# EAGLE design SparkSwitch (EAGLE 9.6.2)
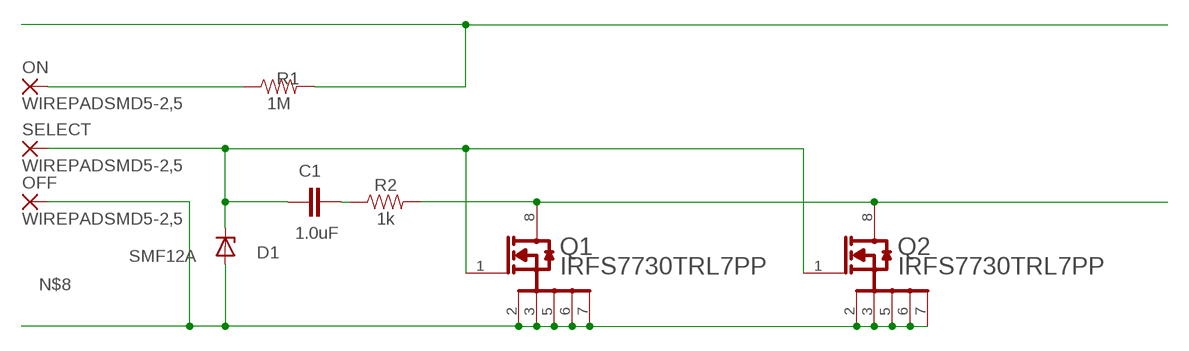
[diagram p0: schematic, sheet 1]

## Parts
C1  1.0uF  1.0UF-0805-25V-(+80/-20%)  [0805]
D1  SMF12A  [SOD123F]
OFF  WIREPADSMD5-2,5  [5-2,5]
ON  WIREPADSMD5-2,5  [5-2,5]
Q1  INFINEON_IRFS7730TRL7PPINFINEON_IRFS7730TRL7PP_0_0  [INFINEON_IRFS7730TRL7PP_0]
Q2  INFINEON_IRFS7730TRL7PPINFINEON_IRFS7730TRL7PP_0_0  [INFINEON_IRFS7730TRL7PP_0]
R1  1M  1MOHM-0603-1/4W-5%  [0603]
R2  1k  1KOHM-0603-1/10W-1%  [0603]
SELECT  WIREPADSMD5-2,5  [5-2,5]

## Nets
N$2: Q1.8(D) Q2.8(D) R2.2
N$3: C1.1 D1.C Q1.1(G) Q2.1(G) SELECT.1(P)
N$4: C1.2 R2.1
N$5: R1.2
N$6: ON.1(P) R1.1
N$8: D1.A OFF.1(P) Q1.2(1_S) Q1.3(2_S) Q1.5(3_S) Q1.6(4_S) Q1.7(5_S) Q2.2(1_S) Q2.3(2_S) Q2.5(3_S) Q2.6(4_S) Q2.7(5_S)

## Library data of the parts
C1 = SparkFun-Capacitors:1.0UF: 1µF ceramic capacitors A capacitor is a passive two-terminal electrical component used to store electrical energy temporarily in an electric field.; PROD_ID: CAP-11625
D1 = smf_10:SMF*A: SMF Series TVS Diodes Source: http://www.littelfuse.com/~/media/electronics/datasheets/tvs_diodes/littelfuse_tvs_diode_smf_datasheet.pdf.pdf; MF: Littelfuse; MPN: SMF12A; OC_FARNELL: unknown; OC_NEWARK: unknown
OFF ON SELECT = wirepad:WIREPAD: Wire PAD connect wire on PCB
Q1 Q2 = Infineon - IRFS7730TRL7PP:INFINEON_IRFS7730TRL7PP: MOSFET N-Channel 75V 240A (Tc) 375W (Tc) Surface Mount D2PAK (7-Lead); AUTOMOTIVE: No; CENTROID_NOT_SPECIFIED: Yes; CONTINUOUS_DRAIN_CURRENT: 240A; DATASHEET: https://www.infineon.com/dgdl/irfs7730-7ppbf.pdf?fileId=5546d462533600a40153563ab68221e0; DEPLETION_MODE: False; DEVICE_CLASS_L1: Discrete Semiconductors; DEVICE_CLASS_L2: Transistors; DEVICE_CLASS_L3: MOSFETs; DIGIKEY_DESCRIPTION: MOSFET N-CH 75V 240A D2PAK; DIGIKEY_PART_NUMBER: IRFS7730TRL7PPCT-ND; DRAIN_TO_SOURCE_BREAKDOWN_VOLTAGE: 75V; DRAIN_TO_SOURCE_RESISTANCE: 1.7mΩ; DRAIN_TO_SOURCE_VOLTAGE: 75V; FOOTPRINT_URL: https://www.infineon.com/cms/en/product/packages/PG-TO263/PG-TO263-7-900/; FOOTPRINT_VARIANT_NAME_0: Recommended_Land_Pattern; GATE_CHARGE_AT_VGS: 285nC @ 10V; GATE_TO_SOURCE_VOLTAGE: 20V; HEIGHT: 5.084mm; INPUT_CAPACITACE_AT_VDS: 13970pF @ 25V; LEAD_FREE: Yes; MAX_FORWARD_DIODE_VOLTAGE: 1.2V; MAX_JUNCTION_TEMP: +175°C; MF: Infineon; MFG_PACKAGE_IDENT: PG-TO263-7; MFG_PACKAGE_IDENT_COMPONENT_ID: 97dda32f29e91852; MFG_PACKAGE_IDENT_DATE: 0; MFG_PACKAGE_IDENT_REV: 900; MOUSER_DESCRIPTION: 75V Single N-Channel HEXFET Power MOSFET in a D2-Pak 7-Lead package, D2PAK7P, RoHS; MOUSER_PART_NUMBER: 942-IRFS7730TRL7PP; MPN: IRFS7730TRL7PP; NUMBER_OF_CHANNELS: 1; NUMBER_OF_N_CHANNELS: 1; PACKAGE: D2PAK7; POWER_DISSIPATION: 375W; PREFIX: Q; PULSE_DRAIN_CURRENT: 990A; REVERSE_RECOVERY_CHARGE: 63nC; REVERSE_RECOVERY_TIME: 42ns; ROHS: Yes; RTHJA_MAX: 40°C/W; STANDOFF_HEIGHT: 0mm; TEMPERATURE_RANGE_HIGH: +175°C; TEMPERATURE_RANGE_LOW: -55°C; THRESHOLD_VGS_MAX: 3.7V; THRESHOLD_VGS_MIN: 2.1V; TURN_OFF_DELAY_TIME: 182ns; TURN_ON_DELAY_TIME: 20ns; VERIFICATION_VERSION: 0.0.0.3
R1 = SparkFun-Resistors:1MOHM: 1MΩ resistor A resistor is a passive two-terminal electrical component that implements electrical resistance as a circuit element. Resistors act to reduce current flow, and, at the same time, act to lower voltage levels within circuits. - Wikipedia; PROD_ID: RES-07868
R2 = SparkFun-Resistors:1KOHM: 1kΩ resistor A resistor is a passive two-terminal electrical component that implements electrical resistance as a circuit element. Resistors act to reduce current flow, and, at the same time, act to lower voltage levels within circuits. - Wikipedia; PROD_ID: RES-07856

## Board
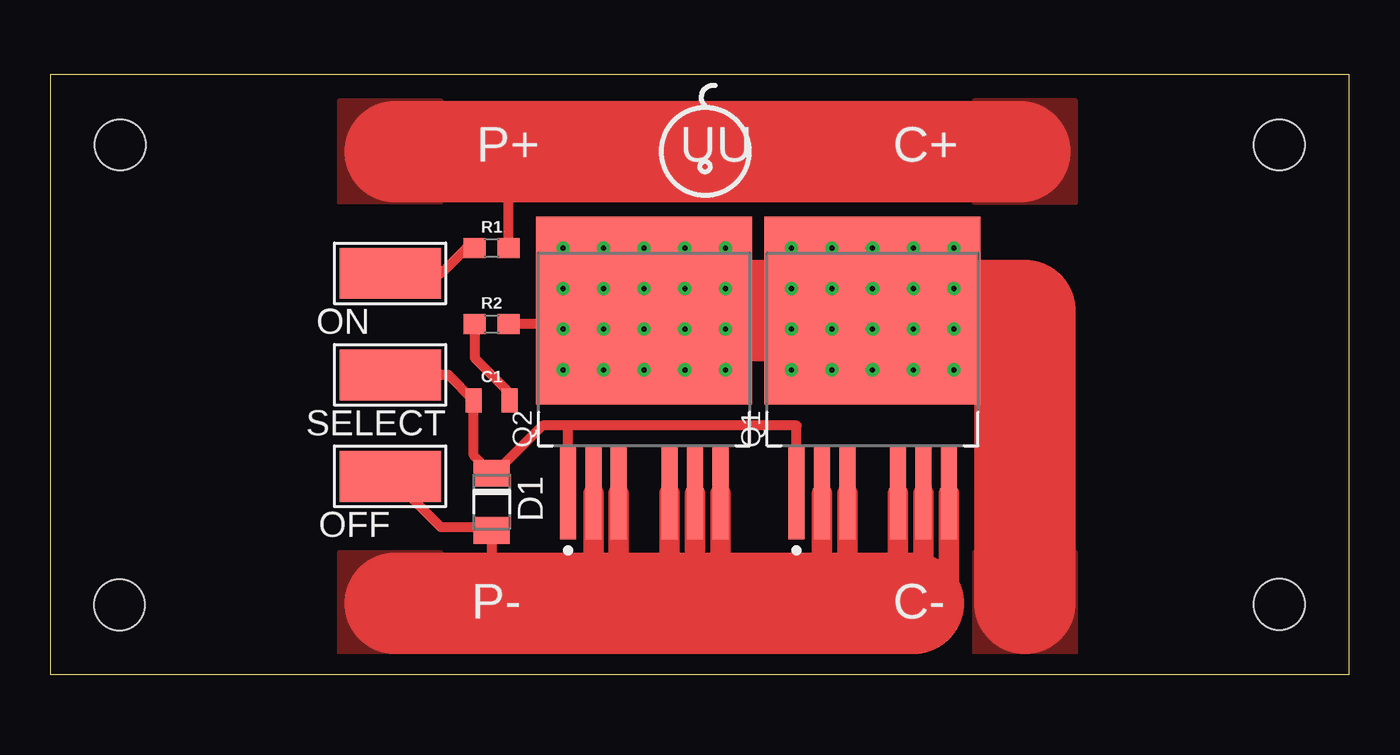
[diagram p1: board, top side]
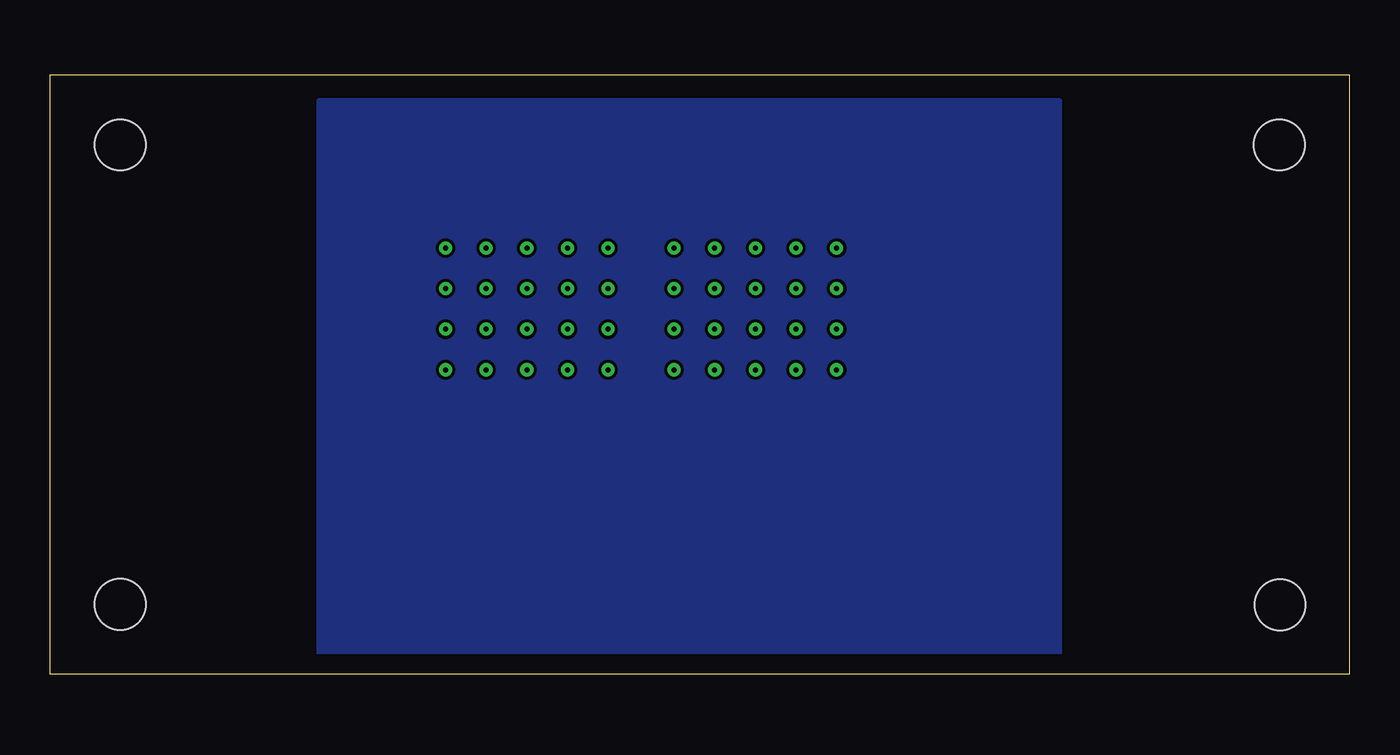
[diagram p2: board, bottom side, seen from below]

Size 65 x 30 mm. Coordinates in mm from the lower left corner, seen from the top.
Outline: 0,0 65,0 65,30 0,30 0,0
Copper layers (1*16): Top 0.035mm / dielectric 1.5mm / Bottom 0.035mm
Design rules "default": minimum track width 6mil, minimum drill 0.35mm, track to track 6mil, track to pad 6mil, pad to pad 6mil, via to via 6mil, smd to smd 6mil, copper to edge 40mil, drill to drill 6mil, minimum pad ring 10mil, minimum via ring 8mil, stop-mask expansion 4mil, vias tented up to drill 0mil, thermal gap 10mil
Holes 2.54 mm at 3.48,3.48 61.49,3.51 3.51,26.49 61.49,26.49

### Footprints (pad centres in the part's own frame; a part is rotated, then mirrored left to right if it is on the bottom)
0805 = smd 0.8 x 1.2: 1 -0.9,0; 2 0.9,0
SOD123F = smd 1.34 x 1.8: A 1.43,0; C -1.43,0
5-2,5 = smd 2.54 x 5.08: 1 0,0
INFINEON_IRFS7730TRL7PP_0 = smd 0.8 x 4.6: 1 -3.81,-7.21; 2 -2.54,-7.21; 3 -1.27,-7.21; 5 1.27,-7.21; 6 2.54,-7.21; 7 3.81,-7.21 | smd 10.8 x 9.4: 8 0,1.94 | smd 0.7 x 4.5: SMD_7 -3.81,-7.21; SMD_8 -2.54,-7.21; SMD_9 -1.27,-7.21; SMD_10 1.27,-7.21; SMD_11 2.54,-7.21; SMD_12 3.81,-7.21 | smd 5.2 x 4.5: SMD_14 -2.75,4.34; SMD_15 2.75,4.34; SMD_16 -2.75,-0.46; SMD_17 2.75,-0.46
0603 = smd 1.1 x 1: 1 -0.85,0; 2 0.85,0

### Placement (x,y rotation side)
C1  22.1,13.72 0 top
D1  22.1,8.64 270 top
OFF  17.02,9.91 90 top
ON  17.02,20.07 90 top
Q1  41.15,16.26 0 top
Q2  29.72,16.26 0 top
R1  22.1,21.34 0 top
R2  22.1,17.53 0 top
SELECT  17.02,14.99 90 top

### Tracks (layer width: path | path; a pad name or v marks a point on that pad's centre or on a via)
N$1  (via drill 0.25)
  other vias: 25.65,21.34
N$2
  Top 0.508: 30.39,18.2 29.72,17.53 | Q2.8 29.72,17.53 | 29.72,17.53 R2.2
  Top 5.08: 30.39,18.2 Q1.8 48.77,18.2 48.77,3.56
  pour Top: 51.31,1.02 51.31,6.1 46.23,6.1 46.23,1.02
N$3
  Top 0.254: D1.C 22.26,9.91
  Top 0.508: SELECT.1 19.93,14.99 C1.1 21.2,10.97 21.92,10.24 21.92,10.07 D1.C 22.1,9.91 24.64,12.45 25.91,12.45 | Q2.1 25.91,12.45 | Q1.1 37.34,12.45 25.91,12.45
N$4
  Top 0.508: R2.1 21.25,15.84 23,14.09 C1.2
N$5
  Top 0.508: R1.2 22.95,26.16
  Top 5.08: 48.51,26.16 22.95,26.16 17.27,26.16
  pour Top: 46.23,28.7 46.23,23.62 51.31,23.62 51.31,28.7
  pour Top: 14.48,28.7 19.56,28.7 19.56,23.62 14.48,23.62
N$6
  Top 0.508: ON.1 19.56,20.07 20.83,21.34 R1.1
N$7  (via drill 0.25)
  other vias: 27.69,21.34
N$8
  Top 0.254: 43.69,3.56 44.96,3.56 | Q1.2 38.61,6.47 | 22.26,7.21 D1.A | 25.91,3.56 27.18,3.56
  Top 0.508: 43.18,3.56 43.69,3.56 | OFF.1 19.56,7.37 21.94,7.37 D1.A 22.1,3.56
  Top 1.016: 38.61,3.56 Q1.2 | Q1.5 42.42,3.56 | Q1.6 43.69,3.56 | Q1.7 44.96,3.56 | Q1.3 39.88,3.56 | Q2.3 28.45,3.56 | Q2.5 30.99,3.56 | Q2.7 33.53,3.56 | Q2.2 27.18,3.56 | Q2.6 32.26,3.56
  Top 5.08: 17.27,3.56 22.1,3.56 27.18,3.56 28.45,3.56 30.99,3.56 32.26,3.56 33.53,3.56 38.61,3.56 39.88,3.56 42.42,3.56 43.18,3.56
  pour Top: 14.48,6.1 19.56,6.1 19.56,1.02 14.48,1.02
N$9  (via drill 0.25)
  other vias: 29.72,21.34
N$10  (via drill 0.25)
  other vias: 31.75,21.34
N$11  (via drill 0.25)
  other vias: 33.78,21.34
N$12  (via drill 0.25)
  other vias: 33.78,19.3
N$13  (via drill 0.25)
  other vias: 31.75,19.3
N$14  (via drill 0.25)
  other vias: 29.72,19.3
N$15  (via drill 0.25)
  other vias: 27.69,19.3
N$16  (via drill 0.25)
  other vias: 25.65,19.3
N$17  (via drill 0.25)
  other vias: 25.65,17.27
N$18  (via drill 0.25)
  other vias: 27.69,17.27
N$19  (via drill 0.25)
  other vias: 29.72,17.27
N$20  (via drill 0.25)
  other vias: 31.75,17.27
N$21  (via drill 0.25)
  other vias: 33.78,17.27
N$22  (via drill 0.25)
  other vias: 33.78,15.24
N$23  (via drill 0.25)
  other vias: 31.75,15.24
N$24  (via drill 0.25)
  other vias: 29.72,15.24
N$25  (via drill 0.25)
  other vias: 27.69,15.24
N$26  (via drill 0.25)
  other vias: 25.65,15.24
N$27  (via drill 0.25)
  other vias: 37.08,21.34
N$28  (via drill 0.25)
  other vias: 39.12,21.34
N$29  (via drill 0.25)
  other vias: 37.08,19.3
N$30  (via drill 0.25)
  other vias: 37.08,17.27
N$31  (via drill 0.25)
  other vias: 37.08,15.24
N$32  (via drill 0.25)
  other vias: 39.12,15.24
N$33  (via drill 0.25)
  other vias: 41.15,15.24
N$34  (via drill 0.25)
  other vias: 43.18,15.24
N$35  (via drill 0.25)
  other vias: 45.21,15.24
N$36  (via drill 0.25)
  other vias: 45.21,17.27
N$37  (via drill 0.25)
  other vias: 45.21,19.3
N$38  (via drill 0.25)
  other vias: 45.21,21.34
N$39  (via drill 0.25)
  other vias: 43.18,21.34
N$40  (via drill 0.25)
  other vias: 41.15,21.34
N$41  (via drill 0.25)
  other vias: 39.12,19.3
N$42  (via drill 0.25)
  other vias: 41.15,19.3
N$43  (via drill 0.25)
  other vias: 43.18,19.3
N$44  (via drill 0.25)
  other vias: 43.18,17.27
N$45  (via drill 0.25)
  other vias: 41.15,17.27
N$46  (via drill 0.25)
  other vias: 39.12,17.27
THERMAL
  pour Bottom: 14.48,1.02 14.48,28.7 51.56,28.7 51.56,1.02

### Text on the board
tNames: P+ | UU | C+ | P- | C-